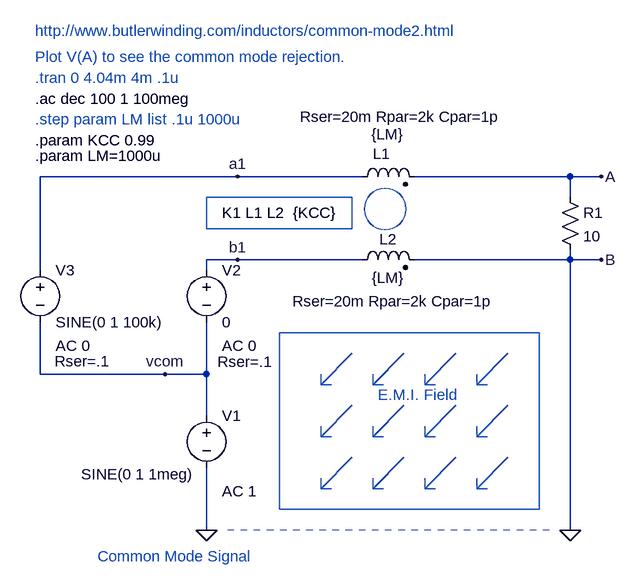
[diagram p0: schematic Common Mode Choke3.asc]
Common Mode Choke3.asc, the LTspice schematic file:
Version 4
SHEET 1 880 680
WIRE 96 -16 -208 -16
WIRE 288 -16 96 -16
WIRE 608 -16 368 -16
WIRE 656 -16 608 -16
WIRE 608 16 608 -16
WIRE 96 112 48 112
WIRE 288 112 96 112
WIRE 608 112 608 96
WIRE 608 112 368 112
WIRE 656 112 608 112
WIRE -208 128 -208 -16
WIRE 48 128 48 112
WIRE -208 288 -208 208
WIRE -16 288 -208 288
WIRE 48 288 48 208
WIRE 48 288 -16 288
WIRE 48 352 48 288
WIRE 48 528 48 432
WIRE 608 528 608 112
FLAG 48 528 0
FLAG 656 -16 A
FLAG 656 112 B
FLAG -16 288 vcom
FLAG 96 -16 a1
FLAG 96 112 b1
FLAG 608 528 0
SYMBOL ind2 272 0 R270
WINDOW 0 51 32 VRight 0
WINDOW 3 81 30 VRight 0
WINDOW 39 108 -80 VRight 0
SYMATTR InstName L1
SYMATTR Value {LM}
SYMATTR SpiceLine Rser=20m Rpar=2k Cpar=1p
SYMATTR Type ind
SYMBOL ind2 272 128 R270
WINDOW 0 32 56 VTop 0
WINDOW 3 4 56 VBottom 0
WINDOW 39 -32 64 VBottom 0
SYMATTR InstName L2
SYMATTR Value {LM}
SYMATTR SpiceLine Rser=20m Rpar=2k Cpar=1p
SYMATTR Type ind
SYMBOL res 592 0 R0
SYMATTR InstName R1
SYMATTR Value 10
SYMBOL voltage -208 112 R0
WINDOW 123 24 132 Left 0
WINDOW 39 22 156 Left 0
SYMATTR Value2 AC 0
SYMATTR SpiceLine Rser=.1
SYMATTR InstName V3
SYMATTR Value SINE(0 1 100k)
SYMBOL voltage 48 336 R0
WINDOW 123 24 132 Left 0
WINDOW 39 26 158 Left 0
WINDOW 3 -20 106 Right 0
SYMATTR Value2 AC 1
SYMATTR InstName V1
SYMATTR Value SINE(0 1 1meg)
SYMBOL voltage 48 112 R0
WINDOW 123 24 132 Left 0
WINDOW 39 17 157 Left 0
SYMATTR Value2 AC 0
SYMATTR SpiceLine Rser=.1
SYMATTR InstName V2
SYMATTR Value 0
TEXT 72 40 Left 0 !K1 L1 L2  {KCC}
TEXT -216 -168 Left 0 ;.tran 0 4.04m 4m .1u
TEXT -120 568 Left 0 ;Common Mode Signal
TEXT -216 -200 Left 0 ;Plot V(A) to see the common mode rejection.
TEXT -216 -136 Left 0 !.ac dec 100 1 100meg
TEXT -216 -72 Left 0 !.param KCC 0.99
TEXT -216 -104 Left 0 ;.step param LM list .1u 1000u
TEXT -216 -48 Left 0 !.param LM=1000u
TEXT 312 320 Left 0 ;E.M.I. Field
TEXT -216 -240 Left 0 ;http://www.butlerwinding.com/inductors/common-mode2.html
LINE Normal 560 496 160 496
LINE Normal 560 224 560 496
LINE Normal 160 224 560 224
LINE Normal 160 496 160 224
LINE Normal 384 304 432 256
LINE Normal 400 304 384 304
LINE Normal 384 304 400 304
LINE Normal 384 288 384 304
LINE Normal 304 304 352 256
LINE Normal 320 304 304 304
LINE Normal 304 304 320 304
LINE Normal 304 288 304 304
LINE Normal 224 304 272 256
LINE Normal 240 304 224 304
LINE Normal 224 304 240 304
LINE Normal 224 288 224 304
LINE Normal 464 304 512 256
LINE Normal 480 304 464 304
LINE Normal 464 304 480 304
LINE Normal 464 288 464 304
LINE Normal 224 384 272 336
LINE Normal 240 384 224 384
LINE Normal 224 384 240 384
LINE Normal 224 368 224 384
LINE Normal 224 464 272 416
LINE Normal 240 464 224 464
LINE Normal 224 464 240 464
LINE Normal 224 448 224 464
LINE Normal 304 384 352 336
LINE Normal 320 384 304 384
LINE Normal 304 384 320 384
LINE Normal 304 368 304 384
LINE Normal 304 464 352 416
LINE Normal 320 464 304 464
LINE Normal 304 464 320 464
LINE Normal 304 448 304 464
LINE Normal 384 384 432 336
LINE Normal 400 384 384 384
LINE Normal 384 384 400 384
LINE Normal 384 368 384 384
LINE Normal 384 464 432 416
LINE Normal 400 464 384 464
LINE Normal 384 464 400 464
LINE Normal 384 448 384 464
LINE Normal 464 384 512 336
LINE Normal 480 384 464 384
LINE Normal 464 384 480 384
LINE Normal 464 368 464 384
LINE Normal 464 464 512 416
LINE Normal 480 464 464 464
LINE Normal 464 464 480 464
LINE Normal 464 448 464 464
LINE Normal 576 528 80 528 1
RECTANGLE Normal 272 64 48 16
CIRCLE Normal 355 66 291 2

The netlist it stands for:
* Common Mode Choke3.asc
L1 a1 A {LM} Rser=20m Rpar=2k Cpar=1p
L2 b1 0 {LM} Rser=20m Rpar=2k Cpar=1p
R1 A 0 10
V3 a1 vcom SINE(0 1 100k) AC 0 Rser=.1
V1 vcom 0 SINE(0 1 1meg) AC 1
V2 b1 vcom 0 AC 0 Rser=.1
K1 L1 L2  {KCC}
* .tran 0 4.04m 4m .1u
* Common Mode Signal
* Plot V(A) to see the common mode rejection.
.ac dec 100 1 100meg
.param KCC 0.99
* .step param LM list .1u 1000u
.param LM=1000u
* E.M.I. Field
* http://www.butlerwinding.com/inductors/common-mode2.html
.backanno
.end